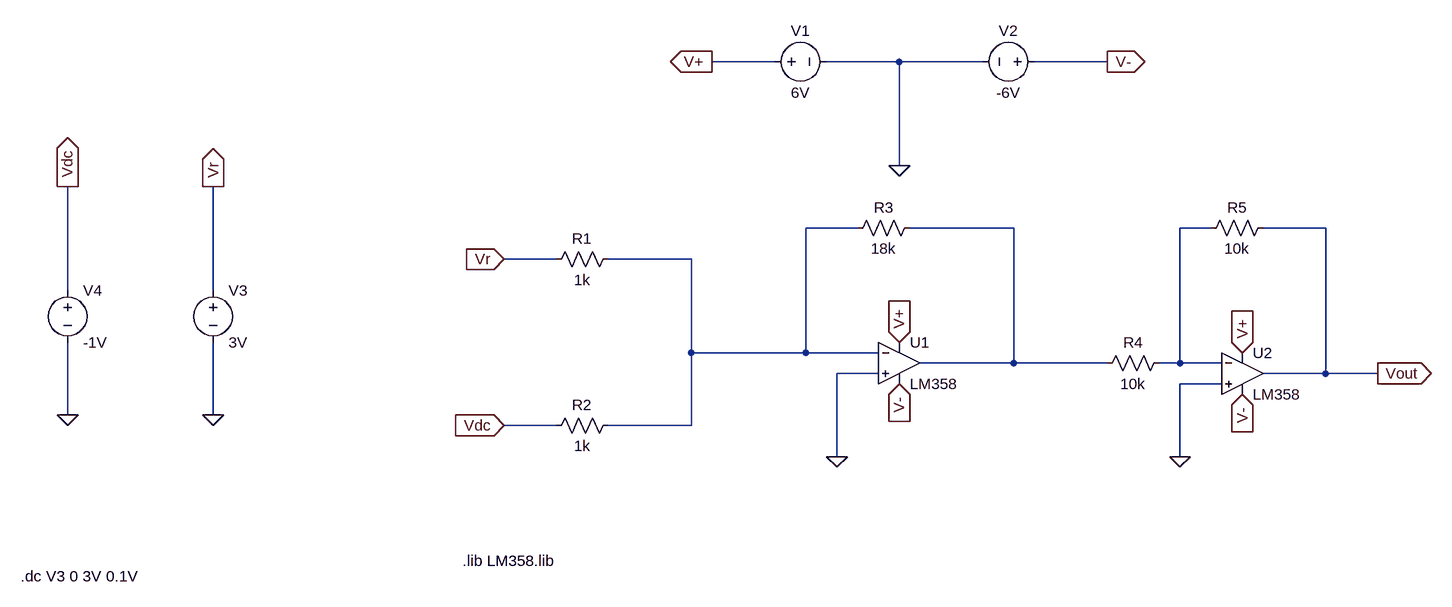
[diagram p0: schematic emulator-triangle-shift-ct-sim.asc]
emulator-triangle-shift-ct-sim.asc, the LTspice schematic file:
Version 4
SHEET 1 1056 680
WIRE 16 -304 -80 -304
WIRE 208 -304 96 -304
WIRE 336 -304 208 -304
WIRE 528 -304 416 -304
WIRE 208 -144 208 -304
WIRE 144 -48 64 -48
WIRE 384 -48 224 -48
WIRE 688 -48 640 -48
WIRE 864 -48 768 -48
WIRE -320 0 -400 0
WIRE -112 0 -240 0
WIRE -1072 48 -1072 -112
WIRE -848 48 -848 -112
WIRE -112 144 -112 0
WIRE 64 144 64 -48
WIRE 64 144 -112 144
WIRE 176 144 64 144
WIRE 384 160 384 -48
WIRE 384 160 240 160
WIRE 528 160 384 160
WIRE 640 160 640 -48
WIRE 640 160 608 160
WIRE 704 160 640 160
WIRE 176 176 112 176
WIRE 864 176 864 -48
WIRE 864 176 768 176
WIRE 944 176 864 176
WIRE 704 192 640 192
WIRE -1072 240 -1072 128
WIRE -848 240 -848 128
WIRE -320 256 -400 256
WIRE -112 256 -112 144
WIRE -112 256 -240 256
WIRE 112 304 112 176
WIRE 640 304 640 192
FLAG 208 -144 0
FLAG -80 -304 V+
IOPIN -80 -304 Out
FLAG 528 -304 V-
IOPIN 528 -304 Out
FLAG 208 128 V+
IOPIN 208 128 In
FLAG 208 192 V-
IOPIN 208 192 In
FLAG -400 0 Vr
IOPIN -400 0 In
FLAG -400 256 Vdc
IOPIN -400 256 In
FLAG 112 304 0
FLAG 944 176 Vout
IOPIN 944 176 Out
FLAG -848 240 0
FLAG -848 -112 Vr
IOPIN -848 -112 Out
FLAG -1072 240 0
FLAG -1072 -112 Vdc
IOPIN -1072 -112 Out
FLAG 736 144 V+
IOPIN 736 144 In
FLAG 736 208 V-
IOPIN 736 208 In
FLAG 640 304 0
SYMBOL OpAmps\\opamp2 208 96 R0
SYMATTR InstName U1
SYMATTR Value LM358
SYMBOL voltage 0 -304 R270
WINDOW 0 32 56 VTop 2
WINDOW 3 -32 56 VBottom 2
SYMATTR InstName V1
SYMATTR Value 6V
SYMBOL voltage 432 -304 R90
WINDOW 0 -32 56 VBottom 2
WINDOW 3 32 56 VTop 2
SYMATTR InstName V2
SYMATTR Value -6V
SYMBOL res -224 -16 R90
WINDOW 0 0 56 VBottom 2
WINDOW 3 32 56 VTop 2
SYMATTR InstName R1
SYMATTR Value 1k
SYMBOL res -224 240 R90
WINDOW 0 0 56 VBottom 2
WINDOW 3 32 56 VTop 2
SYMATTR InstName R2
SYMATTR Value 1k
SYMBOL res 240 -64 R90
WINDOW 0 0 56 VBottom 2
WINDOW 3 32 56 VTop 2
SYMATTR InstName R3
SYMATTR Value 18k
SYMBOL voltage -848 32 R0
SYMATTR InstName V3
SYMATTR Value 3V
SYMBOL voltage -1072 32 R0
SYMATTR InstName V4
SYMATTR Value -1V
SYMBOL OpAmps\\opamp2 736 112 R0
SYMATTR InstName U2
SYMATTR Value LM358
SYMBOL res 624 144 R90
WINDOW 0 0 56 VBottom 2
WINDOW 3 32 56 VTop 2
SYMATTR InstName R4
SYMATTR Value 10k
SYMBOL res 784 -64 R90
WINDOW 0 0 56 VBottom 2
WINDOW 3 32 56 VTop 2
SYMATTR InstName R5
SYMATTR Value 10k
TEXT -464 464 Left 2 !.lib LM358.lib
TEXT -1144 488 Left 2 !.dc V3 0 3V 0.1V

The netlist it stands for:
* emulator-triangle-shift-ct-sim.asc
XU1 0 N001 V+ V- N002 LM358  ; pins In+ In- V+ V- OUT
V1 V+ 0 6V
V2 V- 0 -6V
R1 N001 Vr 1k
R2 N001 Vdc 1k
R3 N002 N001 18k
V3 Vr 0 3V
V4 Vdc 0 -1V
XU2 0 N003 V+ V- Vout LM358  ; pins In+ In- V+ V- OUT
R4 N003 N002 10k
R5 Vout N003 10k
.lib LM358.lib
.dc V3 0 3V 0.1V
.backanno
.end

* Results of the author's LTspice run, read from the files saved beside the schematic
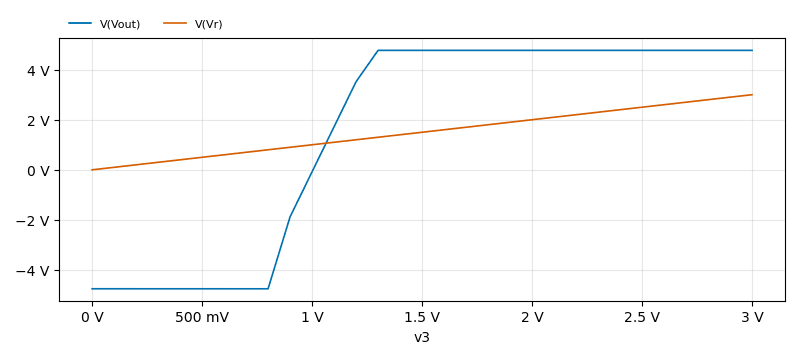
[diagram p1: DC transfer characteristic of emulator-triangle-shift-ct-sim.asc, plotted from the saved traces]
* DC transfer characteristic, 1 run:
*   V(Vout): -4.751 V at v3=0 V, 4.771 V at v3=3 V, min -4.752 V, max 4.771 V
*   V(Vr): 0 V at v3=0 V, 3 V at v3=3 V, min 0 V, max 3 V